# Altium schematic sheet LEAF2GRID.SCHDOC
size A4
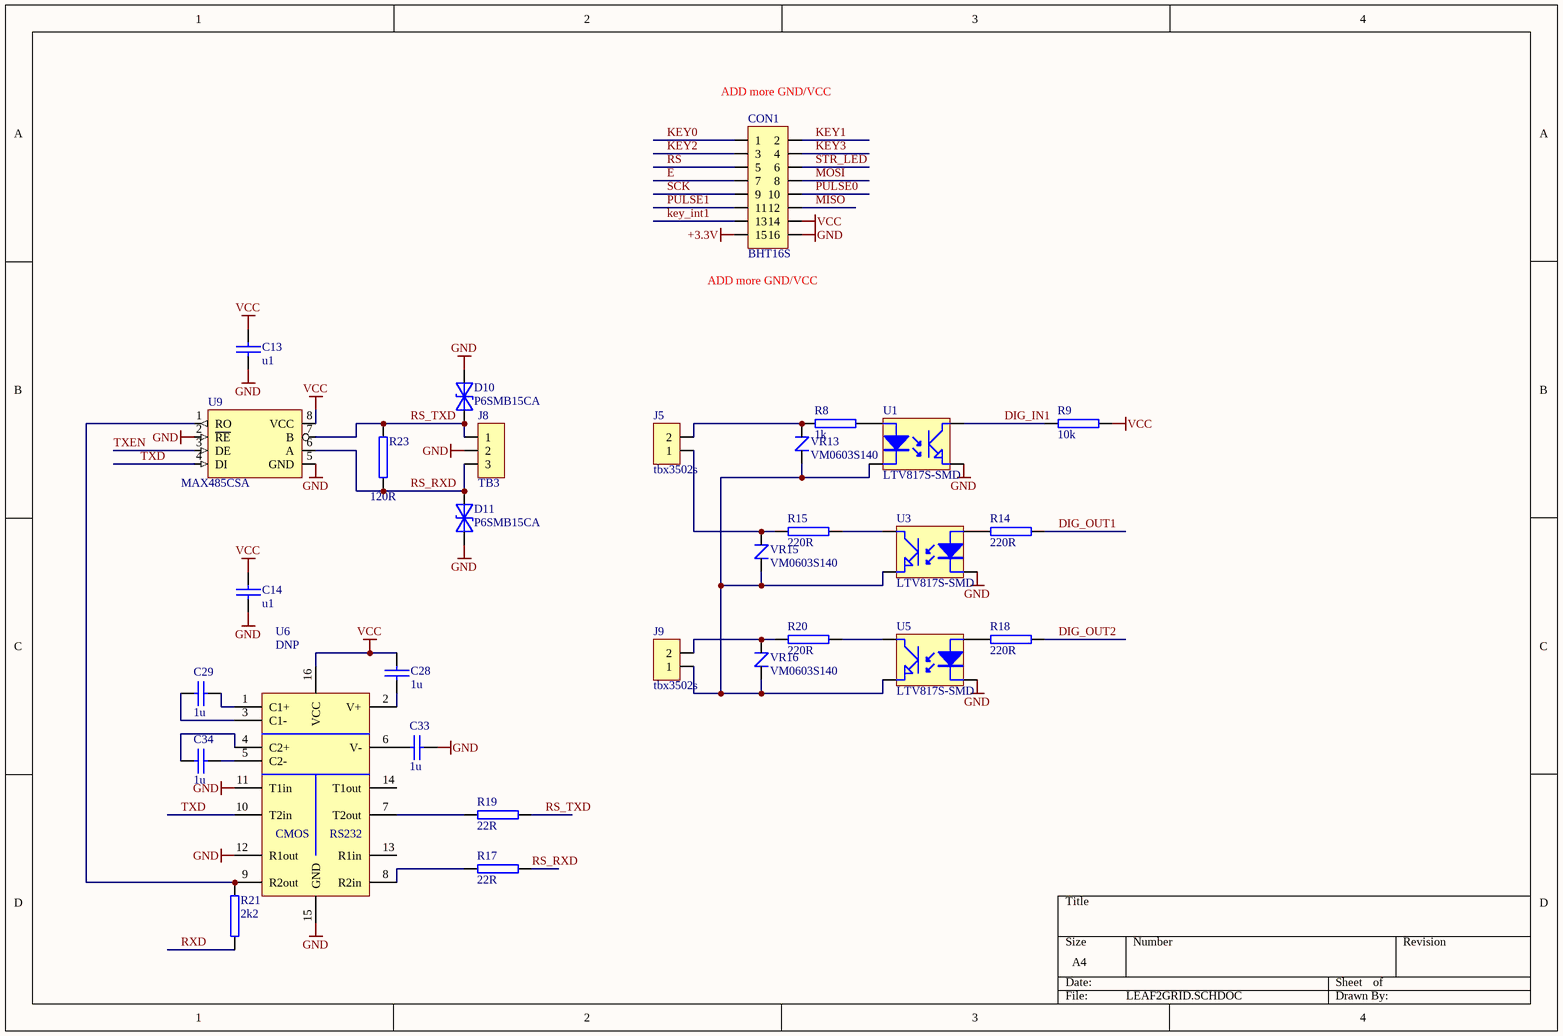
[diagram p0: LEAF2GRID.SCHDOC]

## Parts
C13  u1  [0603]
C14  u1  [0603]
C28  1u  [0805]
C29  1u  [0805]
C33  1u  [0805]
C34  1u  [0805]
CON1  BHT16S  [BHT16S]
D10  P6SMB15CA  [DO-214AA/SMB]
D11  P6SMB15CA  [DO-214AA/SMB]
J5  tbx3502s  [tbx3502s]
J8  TB3  [tbx3503s]
J9  tbx3502s  [tbx3502s]
R8  1k  [0603]
R9  10k  [0603]
R14  220R  [0603]
R15  220R  [0603]
R17  22R  [0603]
R18  220R  [0603]
R19  22R  [0603]
R20  220R  [0603]
R21  2k2  [0603]
R23  120R  [1206]
U1  LTV817S-SMD  [SOP_4]
U3  LTV817S-SMD  [SOP_4]
U5  LTV817S-SMD  [SOP_4]
U6  DNP  [so-16]
U9  MAX485CSA  [SO-8]
VR13  VM0603S140  [0603]
VR15  VM0603S140  [0603]
VR16  VM0603S140  [0603]

## Nets
+3.3V: CON1.15
GND: C13.1 C14.1 C33.2 CON1.16 D10.K D11.A J8.2 U1.4(E) U3.2(K) U5.2(K) U6.11(T1in) U6.12(R1out) U6.15(GND) U9.2(~{RE}) U9.5(GND)
VCC: C13.2 C14.2 C28.2 CON1.14 R9.1 U6.16(VCC) U9.8(VCC)
DIG_IN1: R9.2 U1.3(C)
DIG_OUT1: R14.2
DIG_OUT2: R18.2
E: CON1.7
KEY0: CON1.1
KEY1: CON1.2
KEY2: CON1.3
KEY3: CON1.4
key_int1: CON1.13
MISO: CON1.12
MOSI: CON1.8
PULSE0: CON1.10
PULSE1: CON1.11
RS: CON1.5
RS_RXD: D11.K J8.3 R17.2 R23.1 U9.6(A)
RS_TXD: D10.A J8.1 R19.2 R23.2 U9.7(B)
RXD: R21.1
SCK: CON1.9
STR_LED: CON1.6
TXD: U6.10(T2in) U9.4(DI)
TXEN: U9.3(DE)
NetC28_1: C28.1 U6.2(V+)
NetC29_1: C29.1 U6.3(C1-)
NetC29_2: C29.2 U6.1(C1+)
NetC33_1: C33.1 U6.6(V-)
NetC34_1: C34.1 U6.4(C2+)
NetC34_2: C34.2 U6.5(C2-)
NetJ5_1: J5.1 R15.1 VR15.1
NetJ5_2: J5.2 R8.1 VR13.1
NetJ9_1: J9.1 U1.2(K) U3.4(E) U5.4(E) VR13.2 VR15.2 VR16.2
NetJ9_2: J9.2 R20.1 VR16.1
NetR8_2: R8.2 U1.1(A)
NetR14_1: R14.1 U3.1(A)
NetR15_2: R15.2 U3.3(C)
NetR17_1: R17.1 U6.8(R2in)
NetR18_1: R18.1 U5.1(A)
NetR19_1: R19.1 U6.7(T2out)
NetR20_2: R20.2 U5.3(C)
NetR21_2: R21.2 U6.9(R2out) U9.1(RO)

Not connected (* = marked no-connect by the designer): U6 13(R1in) 14(T1out)

## Notes on the sheet
- (near CON1) ADD more GND/VCC
- (in symbol MAX202) CMOS; RS232

## Library data of the parts
C13 C14 = CAP_SMD: Capacitor SMD
C28 C29 C33 C34 = CAP: Capacitor
CON1 = CON_IDC16_SMT: Maritex BH16S
D10 D11 = TRANSIL 1.5KE: transil 600W
J5 J9 = TB2: Terminal Block
J8 = TB3: Terminal Block
R8 R9 R14 R15 R17-R21 R23 = RES_SMD: SMD Resistor
U1 U3 U5 = OPTO-LTV817S: transoptor
U6 = MAX202: RS232 transceiver (Maritex)
U9 = MAX485
VR13 VR15 VR16 = Varistor VM0805Sxx: varistor SMD(Maritex)